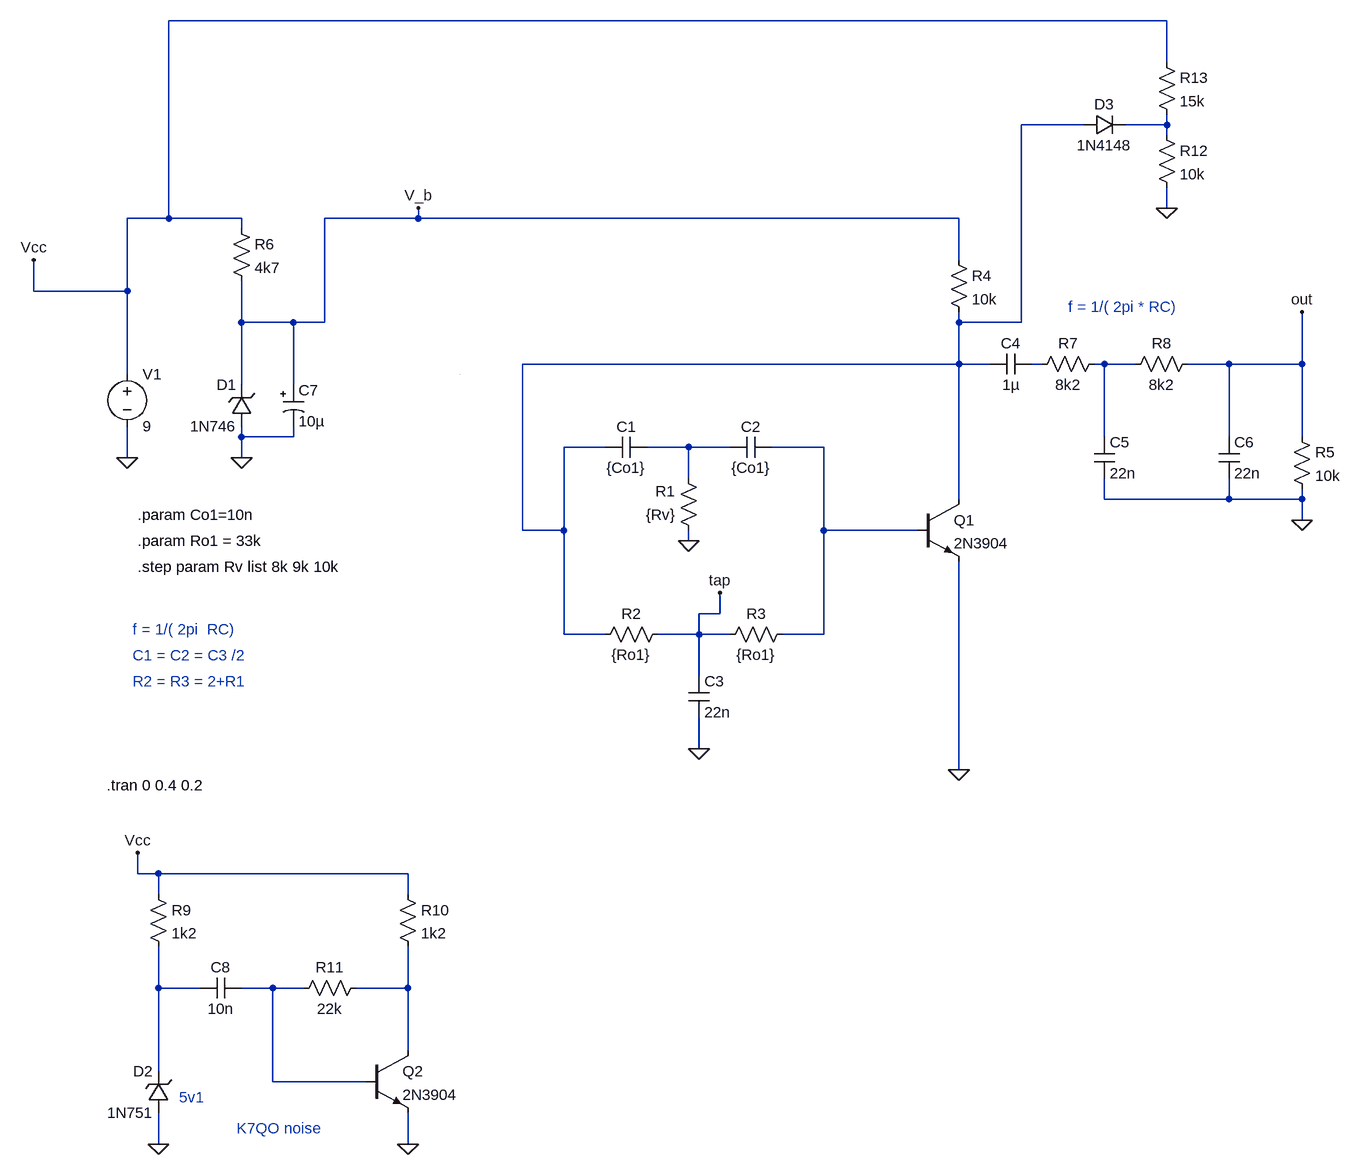
[diagram p0: schematic twin-t-osc-0v02.asc]
twin-t-osc-0v02.asc, the LTspice schematic file:
Version 4
SHEET 1 1364 1204
WIRE 1088 -544 -448 -544
WIRE 1088 -480 1088 -544
WIRE 960 -384 864 -384
WIRE 1088 -384 1088 -400
WIRE 1088 -384 1024 -384
WIRE 1088 -368 1088 -384
WIRE 1088 -256 1088 -288
WIRE -448 -240 -448 -544
WIRE -448 -240 -512 -240
WIRE -336 -240 -448 -240
WIRE -64 -240 -64 -256
WIRE -64 -240 -208 -240
WIRE 768 -240 -64 -240
WIRE -336 -224 -336 -240
WIRE 768 -176 768 -240
WIRE -656 -128 -656 -176
WIRE -512 -128 -512 -240
WIRE -512 -128 -656 -128
WIRE -336 -80 -336 -144
WIRE -256 -80 -336 -80
WIRE -208 -80 -208 -240
WIRE -208 -80 -256 -80
WIRE 768 -80 768 -96
WIRE 864 -80 864 -384
WIRE 864 -80 768 -80
WIRE 768 -16 768 -80
WIRE 768 -16 96 -16
WIRE 816 -16 768 -16
WIRE 896 -16 880 -16
WIRE 992 -16 976 -16
WIRE 1040 -16 992 -16
WIRE 1184 -16 1120 -16
WIRE 1296 -16 1296 -96
WIRE 1296 -16 1184 -16
WIRE -512 0 -512 -128
WIRE -336 16 -336 -80
WIRE -256 16 -256 -80
WIRE -336 96 -336 80
WIRE -256 96 -256 80
WIRE -256 96 -336 96
WIRE 992 96 992 -16
WIRE 1184 96 1184 -16
WIRE 1296 96 1296 -16
WIRE 224 112 160 112
WIRE 352 112 288 112
WIRE 416 112 352 112
WIRE 560 112 480 112
WIRE -512 128 -512 80
WIRE -336 128 -336 96
WIRE 352 160 352 112
WIRE 768 192 768 -16
WIRE 992 192 992 160
WIRE 1184 192 1184 160
WIRE 1184 192 992 192
WIRE 1296 192 1296 176
WIRE 1296 192 1184 192
WIRE 1296 224 1296 192
WIRE 96 240 96 -16
WIRE 160 240 160 112
WIRE 160 240 96 240
WIRE 560 240 560 112
WIRE 704 240 560 240
WIRE 352 256 352 240
WIRE 400 368 400 336
WIRE 400 368 368 368
WIRE 160 400 160 240
WIRE 224 400 160 400
WIRE 368 400 368 368
WIRE 368 400 304 400
WIRE 416 400 368 400
WIRE 560 400 560 240
WIRE 560 400 496 400
WIRE 368 464 368 400
WIRE 368 576 368 528
WIRE 768 608 768 288
WIRE -496 768 -496 736
WIRE -464 768 -496 768
WIRE -80 768 -464 768
WIRE -464 800 -464 768
WIRE -80 800 -80 768
WIRE -464 944 -464 880
WIRE -400 944 -464 944
WIRE -288 944 -336 944
WIRE -240 944 -288 944
WIRE -80 944 -80 880
WIRE -80 944 -160 944
WIRE -80 1040 -80 944
WIRE -464 1072 -464 944
WIRE -288 1088 -288 944
WIRE -144 1088 -288 1088
WIRE -464 1184 -464 1136
WIRE -80 1184 -80 1136
WIRE 0 0 0 0
FLAG 352 256 0
FLAG 368 576 0
FLAG -512 128 0
FLAG 768 608 0
FLAG 1296 -96 out
FLAG 400 336 tap
FLAG 1296 224 0
FLAG -336 128 0
FLAG -464 1184 0
FLAG -656 -176 Vcc
FLAG -496 736 Vcc
FLAG -80 1184 0
FLAG 1088 -256 0
FLAG -64 -256 V_b
SYMBOL cap 288 96 R90
WINDOW 0 0 32 VBottom 2
WINDOW 3 32 32 VTop 2
SYMATTR InstName C1
SYMATTR Value {Co1}
SYMBOL cap 480 96 R90
WINDOW 0 0 32 VBottom 2
WINDOW 3 32 32 VTop 2
SYMATTR InstName C2
SYMATTR Value {Co1}
SYMBOL res 368 256 R180
WINDOW 0 36 76 Left 2
WINDOW 3 36 40 Left 2
SYMATTR InstName R1
SYMATTR Value {Rv}
SYMBOL res 320 384 R90
WINDOW 0 0 56 VBottom 2
WINDOW 3 32 56 VTop 2
SYMATTR InstName R2
SYMATTR Value {Ro1}
SYMBOL cap 352 464 R0
SYMATTR InstName C3
SYMATTR Value 22n
SYMBOL res 512 384 R90
WINDOW 0 0 56 VBottom 2
WINDOW 3 32 56 VTop 2
SYMATTR InstName R3
SYMATTR Value {Ro1}
SYMBOL npn 704 192 R0
SYMATTR InstName Q1
SYMATTR Value 2N3904
SYMBOL res 752 -192 R0
SYMATTR InstName R4
SYMATTR Value 10k
SYMBOL voltage -512 -16 R0
WINDOW 123 0 0 Left 2
WINDOW 39 0 0 Left 2
SYMATTR InstName V1
SYMATTR Value 9
SYMBOL cap 880 -32 R90
WINDOW 0 0 32 VBottom 2
WINDOW 3 32 32 VTop 2
SYMATTR InstName C4
SYMATTR Value 1µ
SYMBOL res 1280 80 R0
SYMATTR InstName R5
SYMATTR Value 10k
SYMBOL zener -320 80 R180
WINDOW 0 24 64 Left 2
WINDOW 3 24 0 Left 2
SYMATTR InstName D1
SYMATTR Value 1N746
SYMBOL res -352 -240 R0
SYMATTR InstName R6
SYMATTR Value 4k7
SYMBOL res 992 -32 R90
WINDOW 0 0 56 VBottom 2
WINDOW 3 32 56 VTop 2
SYMATTR InstName R7
SYMATTR Value 8k2
SYMBOL res 1136 -32 R90
WINDOW 0 0 56 VBottom 2
WINDOW 3 32 56 VTop 2
SYMATTR InstName R8
SYMATTR Value 8k2
SYMBOL cap 976 96 R0
SYMATTR InstName C5
SYMATTR Value 22n
SYMBOL cap 1168 96 R0
SYMATTR InstName C6
SYMATTR Value 22n
SYMBOL polcap -272 16 R0
SYMATTR InstName C7
SYMATTR Value 10µ
SYMBOL zener -448 1136 R180
WINDOW 0 24 64 Left 2
WINDOW 3 24 0 Left 2
SYMATTR InstName D2
SYMATTR Value 1N751
SYMBOL res -480 784 R0
SYMATTR InstName R9
SYMATTR Value 1k2
SYMBOL cap -400 928 M90
WINDOW 0 0 32 VBottom 2
WINDOW 3 32 32 VTop 2
SYMATTR InstName C8
SYMATTR Value 10n
SYMBOL npn -144 1040 R0
SYMATTR InstName Q2
SYMATTR Value 2N3904
SYMBOL res -96 784 R0
SYMATTR InstName R10
SYMATTR Value 1k2
SYMBOL res -144 928 R90
WINDOW 0 0 56 VBottom 2
WINDOW 3 32 56 VTop 2
SYMATTR InstName R11
SYMATTR Value 22k
SYMBOL res 1072 -384 R0
SYMATTR InstName R12
SYMATTR Value 10k
SYMBOL res 1072 -496 R0
SYMATTR InstName R13
SYMATTR Value 15k
SYMBOL diode 960 -368 R270
WINDOW 0 32 32 VTop 2
WINDOW 3 0 32 VBottom 2
SYMATTR InstName D3
SYMATTR Value 1N4148
TEXT -504 472 Left 2 ;R2 = R3 = 2+R1
TEXT -544 632 Left 2 !.tran 0 0.4 0.2
TEXT -496 296 Left 2 !.step param Rv list 8k 9k 10k
TEXT -504 392 Left 2 ;f = 1/( 2pi  RC)
TEXT -504 432 Left 2 ;C1 = C2 = C3 /2
TEXT -432 1112 Left 2 ;5v1
TEXT -344 1160 Left 2 ;K7QO noise
TEXT 936 -104 Left 2 ;f = 1/( 2pi * RC)
TEXT -496 256 Left 2 !.param Ro1 = 33k
TEXT -496 216 Left 2 !.param Co1=10n

The netlist it stands for:
* twin-t-osc-0v02.asc
C1 N005 N001 {Co1}
C2 N006 N005 {Co1}
R1 0 N005 {Rv}
R2 tap N001 {Ro1}
C3 tap 0 22n
R3 N006 tap {Ro1}
Q1 N001 N006 0 0 2N3904
R4 V_b N001 10k
V1 Vcc 0 9
C4 N003 N001 1µ
R5 out 0 10k
D1 0 V_b 1N746
R6 Vcc V_b 4k7
R7 N004 N003 8k2
R8 out N004 8k2
C5 N004 0 22n
C6 out 0 22n
C7 V_b 0 10µ
D2 0 N007 1N751
R9 Vcc N007 1k2
C8 N007 N008 10n
Q2 N009 N008 0 0 2N3904
R10 Vcc N009 1k2
R11 N009 N008 22k
R12 N002 0 10k
R13 Vcc N002 15k
D3 N001 N002 1N4148
.model D D
.lib standard.dio
.model NPN NPN
.model PNP PNP
.lib standard.bjt
* R2 = R3 = 2+R1
.tran 0 0.4 0.2
.step param Rv list 8k 9k 10k
* f = 1/( 2pi  RC)
* C1 = C2 = C3 /2
* 5v1
* K7QO noise
* f = 1/( 2pi * RC)
.param Ro1 = 33k
.param Co1=10n
.backanno
.end